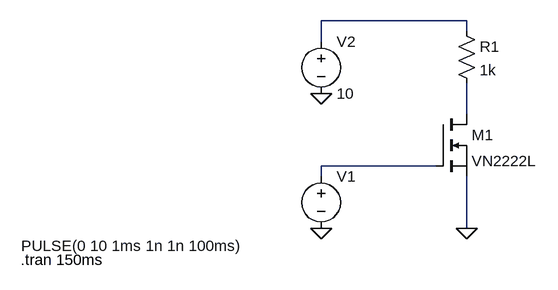
[diagram p0: schematic Draft10.asc]
Draft10.asc, the LTspice schematic file:
Version 4
SHEET 1 880 680
WIRE 208 -32 -16 -32
WIRE 208 -16 208 -32
WIRE -16 0 -16 -32
WIRE 208 112 208 64
WIRE 160 192 -16 192
WIRE -16 208 -16 192
WIRE 208 288 208 208
FLAG -16 288 0
FLAG 208 288 0
FLAG -16 80 0
SYMBOL nmos 160 112 R0
SYMATTR InstName M1
SYMATTR Value VN2222L
SYMBOL voltage -16 192 R0
WINDOW 3 -461 123 Left 2
WINDOW 123 0 0 Left 2
WINDOW 39 0 0 Left 2
SYMATTR InstName V1
SYMATTR Value PULSE(0 10 1ms 1n 1n 100ms)
SYMBOL res 192 -32 R0
SYMATTR InstName R1
SYMATTR Value 1k
SYMBOL voltage -16 -16 R0
WINDOW 123 0 0 Left 2
WINDOW 39 0 0 Left 2
SYMATTR InstName V2
SYMATTR Value 10
TEXT -478 336 Left 2 !.tran 150ms

The netlist it stands for:
* Draft10.asc
M1 N002 N003 0 0 VN2222L
V1 N003 0 PULSE(0 10 1ms 1n 1n 100ms)
R1 N001 N002 1k
V2 N001 0 10
.model NMOS NMOS
.model PMOS PMOS
.lib standard.mos
.tran 150ms
.backanno
.end